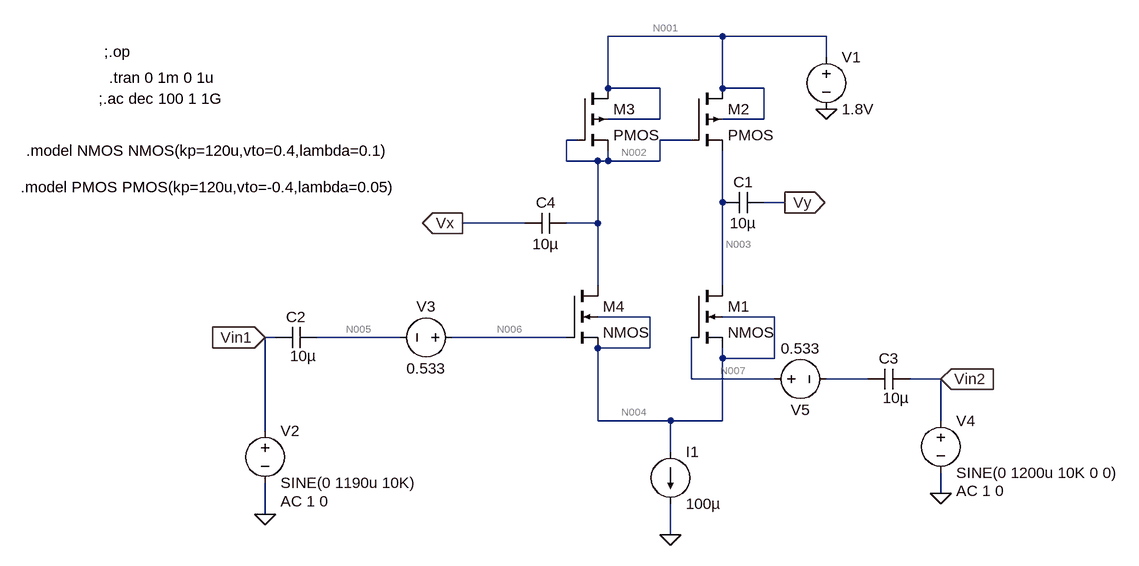
[diagram p0: schematic mirror_active.asc]
mirror_active.asc, the LTspice schematic file:
Version 4
SHEET 1 1084 772
WIRE 240 -16 64 -16
WIRE 400 -16 240 -16
WIRE 400 16 400 -16
WIRE 64 64 64 -16
WIRE 144 64 64 64
WIRE 240 64 240 -16
WIRE 304 64 240 64
WIRE 144 112 144 64
WIRE 144 112 64 112
WIRE 304 112 304 64
WIRE 304 112 240 112
WIRE 16 144 0 144
WIRE 192 144 144 144
WIRE 0 176 0 144
WIRE 48 176 0 176
WIRE 64 176 64 160
WIRE 64 176 48 176
WIRE 144 176 144 144
WIRE 144 176 64 176
WIRE 240 240 240 160
WIRE 336 240 304 240
WIRE -64 272 -160 272
WIRE 48 272 48 176
WIRE 48 272 0 272
WIRE 48 368 48 272
WIRE 240 368 240 240
WIRE 128 416 48 416
WIRE 320 416 240 416
WIRE -448 448 -464 448
WIRE -256 448 -384 448
WIRE 0 448 -176 448
WIRE 128 464 128 416
WIRE 128 464 48 464
WIRE 240 480 240 464
WIRE 320 480 320 416
WIRE 320 480 240 480
WIRE 192 512 192 448
WIRE 320 512 192 512
WIRE 464 512 400 512
WIRE 576 512 528 512
WIRE 48 576 48 464
WIRE 160 576 48 576
WIRE 240 576 240 480
WIRE 240 576 160 576
WIRE 576 576 576 512
WIRE -464 592 -464 448
WIRE 160 624 160 576
WIRE 576 688 576 656
WIRE -464 720 -464 672
WIRE 160 752 160 704
FLAG 400 96 0
FLAG 336 240 Vy
IOPIN 336 240 Out
FLAG 160 752 0
FLAG -464 720 0
FLAG 576 688 0
FLAG -160 272 Vx
IOPIN -160 272 Out
FLAG -464 448 Vin1
IOPIN -464 448 In
FLAG 576 512 Vin2
IOPIN 576 512 In
SYMBOL pmos4 192 64 R0
SYMATTR InstName M2
SYMATTR Value2 l=10u w=10u
SYMBOL voltage 400 0 R0
WINDOW 123 0 0 Left 0
WINDOW 39 0 0 Left 0
SYMATTR InstName V1
SYMATTR Value 1.8V
SYMBOL cap 304 224 R90
WINDOW 0 0 32 VBottom 2
WINDOW 3 32 32 VTop 2
SYMATTR InstName C1
SYMATTR Value 10µ
SYMBOL nmos4 192 368 R0
SYMATTR InstName M1
SYMATTR Value2 l=1.0u w=46.8u
SYMBOL pmos4 16 64 R0
SYMATTR InstName M3
SYMATTR Value2 l=10u w=10u
SYMBOL voltage -464 576 R0
WINDOW 123 24 124 Left 2
WINDOW 39 0 0 Left 0
SYMATTR Value2 AC 1 0
SYMATTR InstName V2
SYMATTR Value SINE(0 1190u 10K)
SYMBOL cap -384 432 R90
WINDOW 0 0 32 VBottom 2
WINDOW 3 29 21 VTop 2
SYMATTR InstName C2
SYMATTR Value 10µ
SYMBOL voltage -160 448 R90
WINDOW 0 -32 56 VBottom 2
WINDOW 3 32 56 VTop 2
WINDOW 123 0 0 Left 0
WINDOW 39 0 0 Left 0
SYMATTR InstName V3
SYMATTR Value 0.533
SYMBOL nmos4 0 368 R0
SYMATTR InstName M4
SYMATTR Value2 l=1.0u w=46.8u
SYMBOL current 160 624 R0
WINDOW 123 0 0 Left 0
WINDOW 39 0 0 Left 0
SYMATTR InstName I1
SYMATTR Value 100µ
SYMBOL voltage 576 560 R0
WINDOW 123 24 124 Left 2
WINDOW 39 0 0 Left 0
SYMATTR Value2 AC 1 0
SYMATTR InstName V4
SYMATTR Value SINE(0 1200u 10K 0 0)
SYMBOL voltage 304 512 R270
WINDOW 0 -32 56 VBottom 2
WINDOW 3 32 56 VTop 2
WINDOW 123 0 0 Left 0
WINDOW 39 0 0 Left 0
SYMATTR InstName V5
SYMATTR Value 0.533
SYMBOL cap 528 496 R90
WINDOW 0 0 32 VBottom 2
WINDOW 3 29 21 VTop 2
SYMATTR InstName C3
SYMATTR Value 10µ
SYMBOL cap 0 256 R90
WINDOW 0 0 32 VBottom 2
WINDOW 3 32 32 VTop 2
SYMATTR InstName C4
SYMATTR Value 10µ
TEXT -832 160 Left 2 !.model NMOS NMOS(kp=120u,vto=0.4,lambda=0.1)
TEXT -840 216 Left 2 !.model PMOS PMOS(kp=120u,vto=-0.4,lambda=0.05)
TEXT -704 48 Left 2 !.tran 0 1m 0 1u
TEXT -712 8 Left 2 !;.op
TEXT -720 80 Left 2 !;.ac dec 100 1 1G

The netlist it stands for:
* mirror_active.asc
M2 N001 N002 N003 N001 PMOS l=10u w=10u
V1 N001 0 1.8V
C1 Vy N003 10µ
M1 N003 N007 N004 N004 NMOS l=1.0u w=46.8u
M3 N001 N002 N002 N001 PMOS l=10u w=10u
V2 Vin1 0 SINE(0 1190u 10K) AC 1 0
C2 N005 Vin1 10µ
V3 N006 N005 0.533
M4 N002 N006 N004 N004 NMOS l=1.0u w=46.8u
I1 N004 0 100µ
V4 Vin2 0 SINE(0 1200u 10K 0 0) AC 1 0
V5 N007 N008 0.533
C3 Vin2 N008 10µ
C4 N002 Vx 10µ
.model NMOS NMOS
.model PMOS PMOS
.lib standard.mos
.model NMOS NMOS(kp=120u,vto=0.4,lambda=0.1)
.model PMOS PMOS(kp=120u,vto=-0.4,lambda=0.05)
.tran 0 1m 0 1u
;.op
;.ac dec 100 1 1G
.backanno
.end

* Results of the author's LTspice run, read from the files saved beside the schematic
* Operating Point, zero values left out:
*   V(n001) = 1.8 V
*   V(n002) = 525.5 mV
*   V(n003) = -511.4 mV
*   V(vy) = -5.114 µV
*   V(n007) = 533 mV
*   V(n004) = -525.4 mV
*   V(n005) = -533 mV
*   V(n006) = 5.33 µV
*   V(vx) = 5.255 µV
*   Id(M4) = 48.81 µA
*   Ib(M4) = -1.061 pA
*   Is(M4) = -48.81 µA
*   Id(M1) = 51.19 µA
*   Is(M1) = -51.19 µA
*   Id(M3) = 48.81 µA
*   Ib(M3) = 1.285 pA
*   Is(M3) = -48.81 µA
*   Id(M2) = 51.19 µA
*   Ib(M2) = 2.321 pA
*   Is(M2) = -51.19 µA
*   I(I1) = 100 µA
*   I(V1) = -100 µA
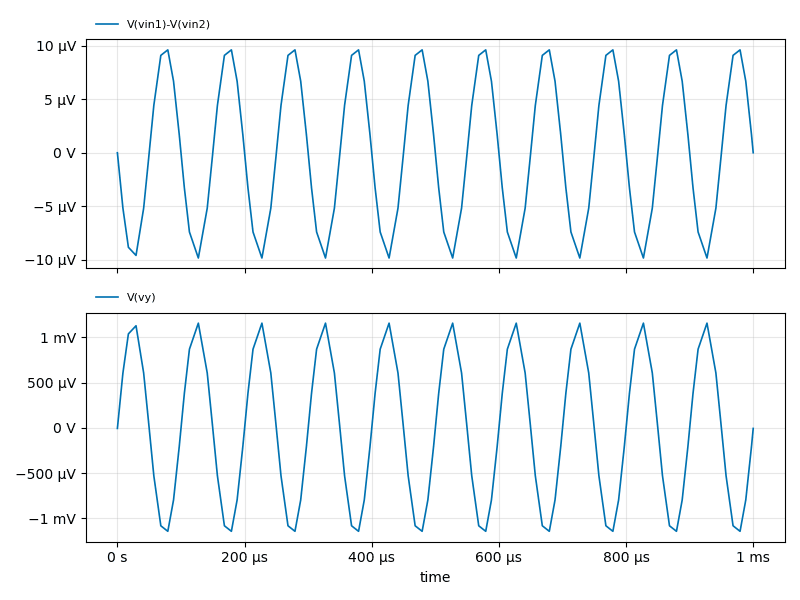
[diagram p1: Transient Analysis of mirror_active.asc, plotted from the saved traces]
* Transient Analysis, 1 run:
*   V(vin1)-V(vin2): min -9.861 µV, max 9.635 µV, average 63.79 nV, rms 6.939 µV, last 0 V
*   V(vy): min -1.142 mV, max 1.158 mV, average -12.61 µV, rms 818.6 µV, last -5.082 µV